# EAGLE schematic final schematic power consumption board (EAGLE 9.3.1)
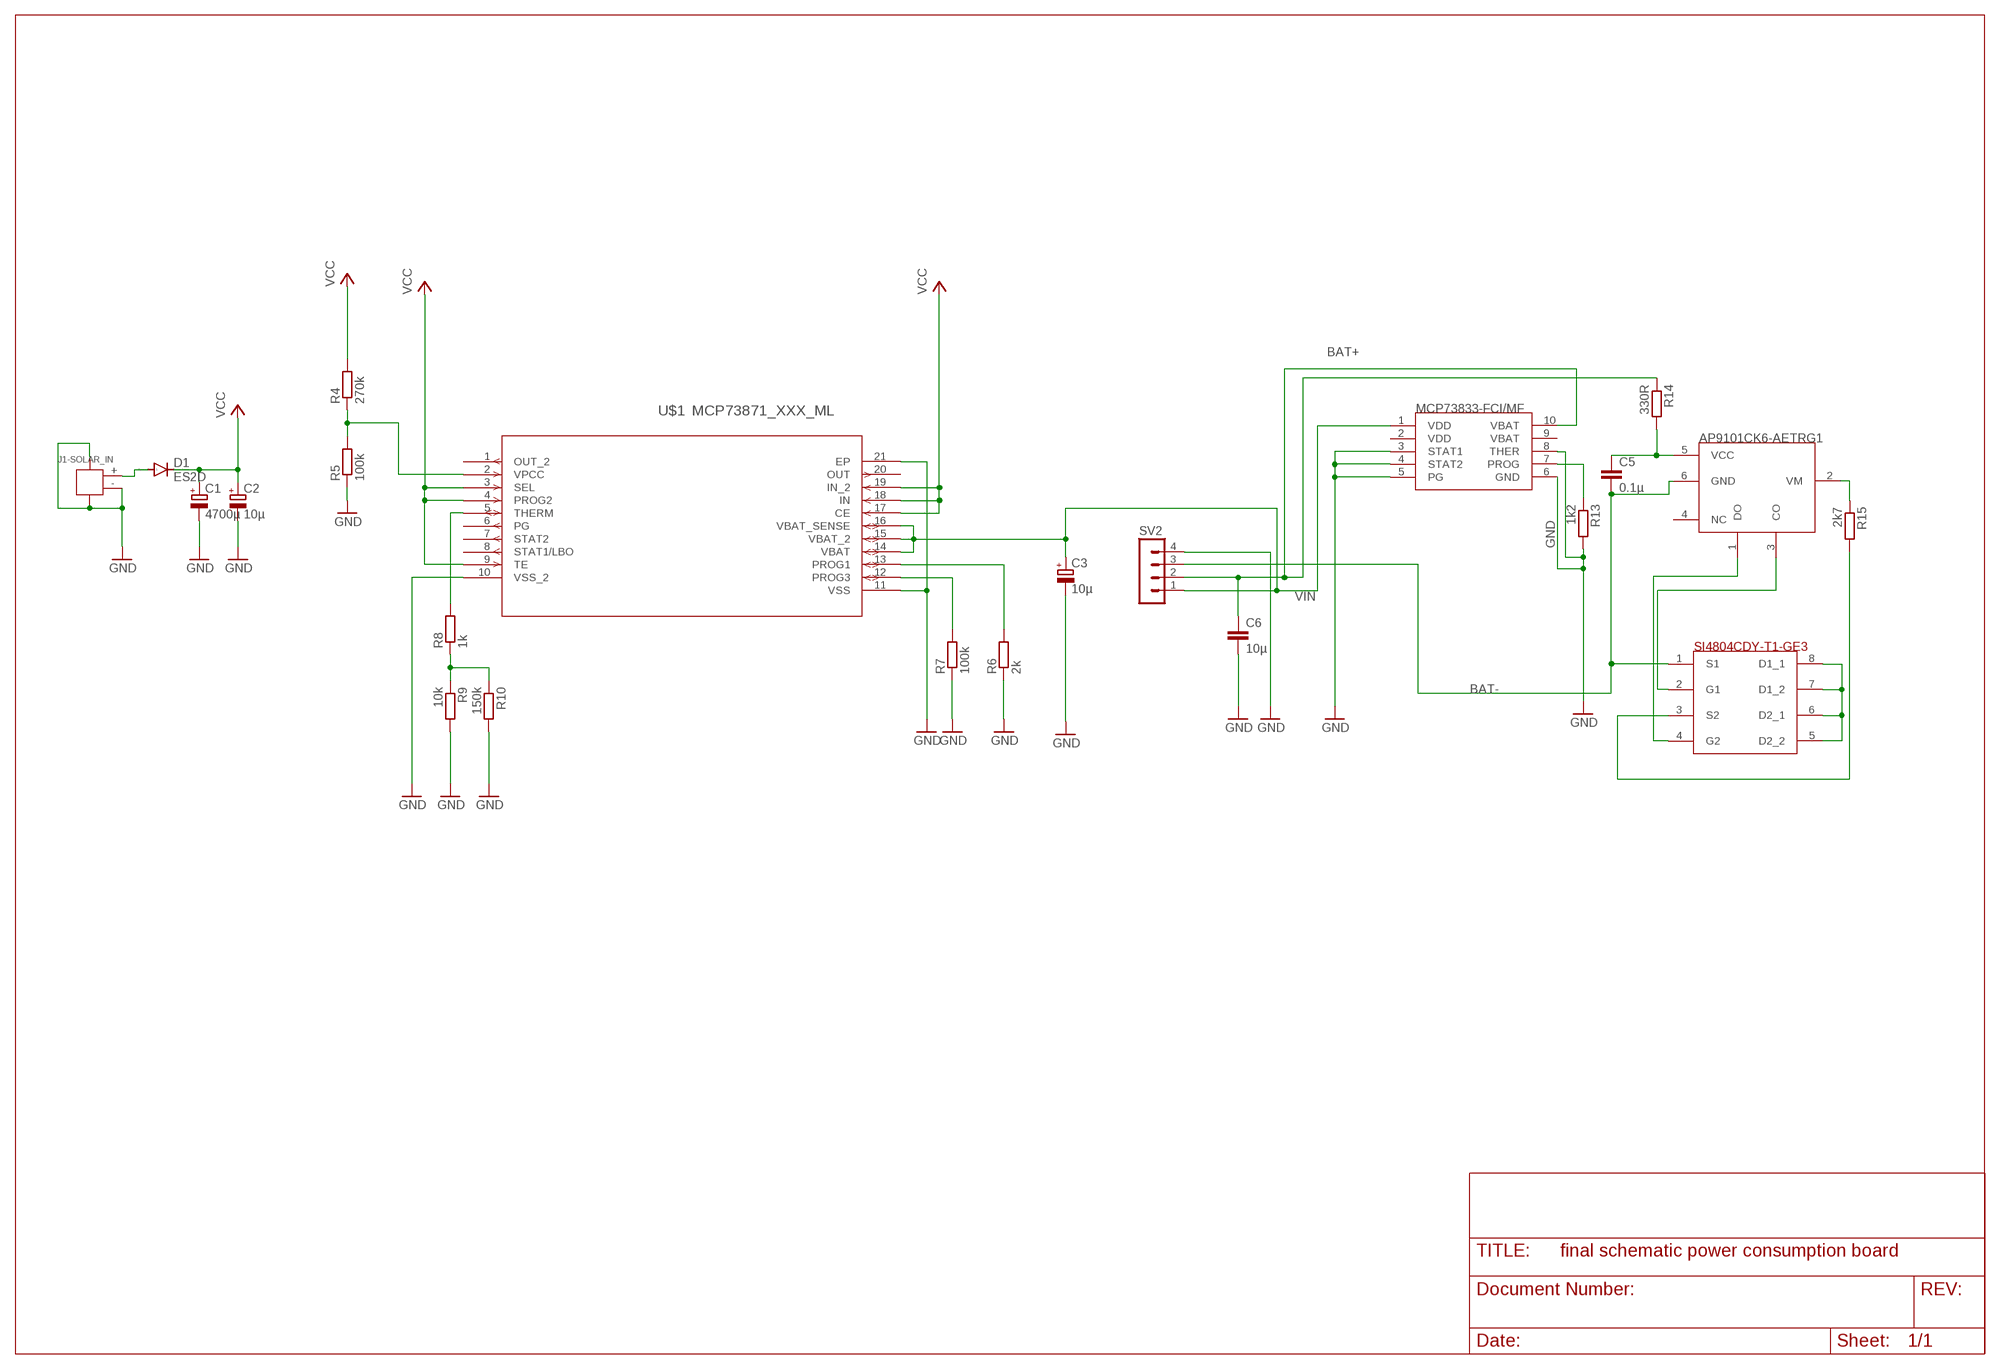
[diagram p0: schematic, sheet 1]

## Parts
C1  4700µ  CPOL-EU153CLV-0505  [153CLV-0505]
C2  10µ  CPOL-EU153CLV-0505  [153CLV-0505]
C3  10µ  CPOL-EU153CLV-0505  [153CLV-0505]
C5  0.1µ  C-EUC1206  [C1206]
C6  10µ  C-EUC1206  [C1206]
D1  ES2D  [SMB]
J1-SOLAR_IN  CONN-HEADER-SMD-PH-SIDE-(2P-2.0MM)  [HW2-SMD-2.0-90D]
R4  270k  R-EU_R0603  [R0603]
R5  100k  R-EU_R0603  [R0603]
R6  2k  R-EU_R0603  [R0603]
R7  100k  R-EU_R0603  [R0603]
R8  1k  R-EU_R0603  [R0603]
R9  10k  R-EU_R0603  [R0603]
R10  150k  R-EU_R0603  [R0603]
R13  1k2  R-EU_R1206W  [R1206W]
R14  330R  R-EU_R1206W  [R1206W]
R15  2k7  R-EU_R1206W  [R1206W]
SV2  MA04-1  [MA04-1]
U$1  MCP73871_XXX_ML  [QFN20_4X4MC]
U$2  AP9101CK6-AETRG1  [SOT-23-6]
U$3  MCP73833-FCI/MF  [SOP50P490X110-10N]
U$4  SI4804CDY-T1-GE3  [SOIC-8]

## Nets
BAT+: C6.1 R14.1 SV2.2 U$3.10(VBAT)
BAT-: C5.2 SV2.3 U$2.6(GND) U$4.1(S1)
GND: C1.- C2.- C3.- C6.2 J1-SOLAR_IN.3 J1-SOLAR_IN.4 J1-SOLAR_IN.- R5.1 R6.1 R7.1 R9.2 R10.2 R13.2 SV2.4 U$1.10(VSS_2) U$1.11(VSS) U$1.21(EP) U$3.3(STAT1) U$3.4(STAT2) U$3.5(PG) U$3.6(GND) U$3.8(THER)
N$1: U$4.5(D2_2) U$4.6(D2_1) U$4.7(D1_2) U$4.8(D1_1)
N$3: R13.1 U$3.7(PROG)
N$7: R4.1 R5.2 U$1.2(VPCC)
N$8: R7.2 U$1.12(PROG3)
N$9: R8.1 R9.1 R10.1
N$10: R6.2 U$1.13(PROG1)
N$13: D1.A J1-SOLAR_IN.+
N$14: R8.2 U$1.5(THERM)
N$18: C5.1 R14.2 U$2.5(VCC)
N$19: R15.1 U$2.2(VM)
N$21: U$2.3(CO) U$4.2(G1)
N$22: U$2.1(DO) U$4.4(G2)
N$24: R15.2 U$4.3(S2)
VCC: C1.+ C2.+ D1.C R4.2 U$1.3(SEL) U$1.4(PROG2) U$1.9(TE) U$1.17(CE) U$1.18(IN) U$1.19(IN_2)
VIN: C3.+ SV2.1 U$1.14(VBAT) U$1.15(VBAT_2) U$1.16(VBAT_SENSE) U$3.1(VDD)
Unconnected: U$1.1(OUT_2) U$1.6(PG) U$1.7(STAT2) U$1.8(STAT1/LBO) U$1.20(OUT) U$2.4(NC) U$3.2(VDD) U$3.9(VBAT)

## Library data of the parts
C1-C3 = rcl:CPOL-EU: POLARIZED CAPACITOR, European symbol; SPICEPREFIX: C
C5 C6 = rcl:C-EU: CAPACITOR, European symbol; SPICEPREFIX: C
D1 = diode:ES2D: DIODE super fast rectifier, 2 A
J1-SOLAR_IN = connectors2:CONN-HEADER-SMD-PH-SIDE-(2P-2.0MM): 320110026; VALUE: 2P-2.0-90D-SMD
R4-R10 R13-R15 = rcl:R-EU_: RESISTOR, European symbol; SPICEPREFIX: R
SV2 = con-lstb:MA04-1: PIN HEADER; OC_FARNELL: unknown; OC_NEWARK: unknown
U$1 = MCP73871:MCP73871_XXX_ML
U$2 = AP9101CK6-AETRG1:AP9101CK6-AETRG1
U$3 = SON50P300X300X100-11N:MCP73833-FCI/MF
U$4 = SI4804CDY-T1-GE3:SI4804CDY-T1-GE3